# Altium project My RCS.PrjPcb
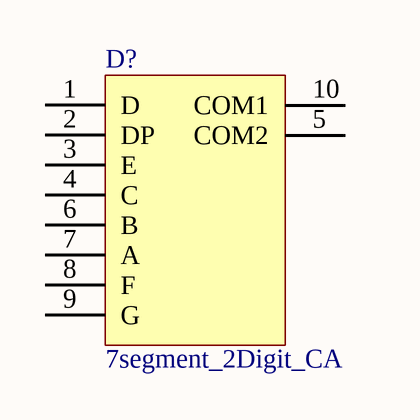
[diagram p0: Controller.SchDoc]
7 sheets, 1 parts. Net scope: strictly hierarchical (ports join the sheet entries above them; power ports are local).
Board file: PCB.PcbDoc
Sheets:
  Controller.SchDoc
  Supply.SchDoc
  Outputs.SchDoc
  Inputs.SchDoc
  GSM.SchDoc
  Remote.SchDoc
  aLCD.SchDoc

## Sheet Controller.SchDoc
size A4; SheetNumber: 1; SheetTotal: 7

### Parts
D?  7segment_2Digit_CA  [7segment_2Digit_CA]

### Nets

Not connected (* = marked no-connect by the designer): D? 1(D) 2(DP) 3(E) 4(C) 5(COM2) 6(B) 7(A) 8(F) 9(G) 10(COM1)

### Library data of the parts
D? = 7segment_2Digit_CA: 7segment_2Digit_CA (4021BS) 20.1 * 16

## Sheet Supply.SchDoc
size A; SheetNumber: 2; SheetTotal: 3

## Sheet Outputs.SchDoc
size A; SheetNumber: 3; SheetTotal: 3

## Sheet Inputs.SchDoc
size A; SheetNumber: 4; SheetTotal: 4

## Sheet GSM.SchDoc
size A; SheetNumber: 5; SheetTotal: 7

## Sheet Remote.SchDoc
size A; SheetNumber: 6; SheetTotal: 7

## Sheet aLCD.SchDoc
size A; SheetNumber: 7; SheetTotal: 7